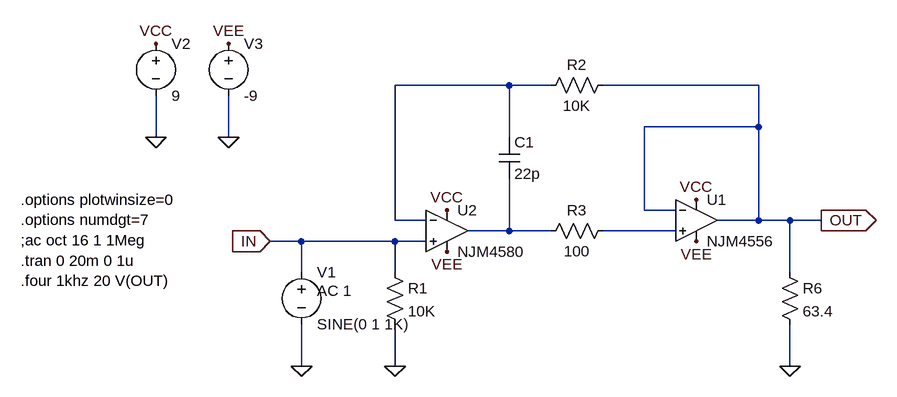
[diagram p0: schematic njm.headphone.amplifier.asc]
njm.headphone.amplifier.asc, the LTspice schematic file:
Version 4
SHEET 1 880 680
WIRE 128 -352 -48 -352
WIRE 192 -352 128 -352
WIRE 512 -352 272 -352
WIRE 512 -288 512 -352
WIRE 512 -288 336 -288
WIRE -416 -272 -416 -336
WIRE -304 -272 -304 -336
WIRE 128 -272 128 -352
WIRE 336 -160 336 -288
WIRE 384 -160 336 -160
WIRE -48 -144 -48 -352
WIRE 0 -144 -48 -144
WIRE 512 -144 512 -288
WIRE 512 -144 448 -144
WIRE 560 -144 512 -144
WIRE 608 -144 560 -144
WIRE 128 -128 128 -208
WIRE 128 -128 64 -128
WIRE 192 -128 128 -128
WIRE 384 -128 272 -128
WIRE -192 -112 -240 -112
WIRE -48 -112 -192 -112
WIRE 0 -112 -48 -112
WIRE -192 -64 -192 -112
WIRE -48 -64 -48 -112
WIRE 560 -64 560 -144
WIRE -192 80 -192 16
WIRE -48 80 -48 16
WIRE 560 80 560 16
FLAG 608 -144 OUT
IOPIN 608 -144 Out
FLAG -48 80 0
FLAG 560 80 0
FLAG -192 80 0
FLAG 32 -160 VCC
FLAG 416 -176 VCC
FLAG 32 -96 VEE
FLAG 416 -112 VEE
FLAG -240 -112 IN
IOPIN -240 -112 In
FLAG -416 -416 VCC
FLAG -304 -416 VEE
FLAG -416 -272 0
FLAG -304 -272 0
SYMBOL res -64 -80 R0
SYMATTR InstName R1
SYMATTR Value 10K
SYMATTR SpiceLine tol=1 pwr=0.1
SYMBOL res 288 -368 R90
WINDOW 0 0 56 VBottom 2
WINDOW 3 32 56 VTop 2
SYMATTR InstName R2
SYMATTR Value 10K
SYMATTR SpiceLine tol=1 pwr=0.1
SYMBOL res 288 -144 R90
WINDOW 0 0 56 VBottom 2
WINDOW 3 32 56 VTop 2
SYMATTR InstName R3
SYMATTR Value 100
SYMATTR SpiceLine tol=1 pwr=0.1
SYMBOL res 544 -80 R0
SYMATTR InstName R6
SYMATTR Value 63.4
SYMATTR SpiceLine tol=1 pwr=0.1
SYMBOL voltage -192 -80 R0
WINDOW 123 24 44 Left 2
WINDOW 39 0 0 Left 2
SYMATTR Value2 AC 1
SYMATTR InstName V1
SYMATTR Value SINE(0 1 1K)
SYMBOL voltage -416 -432 R0
WINDOW 123 0 0 Left 2
WINDOW 39 0 0 Left 2
SYMATTR InstName V2
SYMATTR Value 9
SYMBOL voltage -304 -432 R0
WINDOW 123 0 0 Left 2
WINDOW 39 0 0 Left 2
SYMATTR InstName V3
SYMATTR Value -9
SYMBOL cap 112 -272 R0
SYMATTR InstName C1
SYMATTR Value 22p
SYMATTR SpiceLine V=16 Irms=0 Rser=0.304815 Lser=0.302429f mfg="Wuerth Elektronik" pn="885012005027 WCAP-CSGP 0402" type="NP0"
SYMBOL Opamps\\extra_lib\\NJM4556 416 -208 R0
SYMATTR InstName U1
SYMBOL Opamps\\extra_lib\\NJM4580 32 -192 R0
SYMATTR InstName U2
TEXT -624 -176 Left 2 !.options plotwinsize=0\n.options numdgt=7\n;ac oct 16 1 1Meg\n.tran 0 20m 0 1u\n.four 1khz 20 V(OUT)

The netlist it stands for:
* njm.headphone.amplifier.asc
R1 IN 0 10K tol=1 pwr=0.1
R2 OUT N001 10K tol=1 pwr=0.1
R3 N003 N002 100 tol=1 pwr=0.1
R6 OUT 0 63.4 tol=1 pwr=0.1
V1 IN 0 SINE(0 1 1K) AC 1
V2 VCC 0 9
V3 VEE 0 -9
C1 N001 N002 22p V=16 Irms=0 Rser=0.304815 Lser=0.302429f mfg="Wuerth Elektronik" pn="885012005027 WCAP-CSGP 0402" type="NP0"
XU1 N003 OUT VCC VEE OUT NJM4556  ; pins In+ In- V+ V- OUT
XU2 IN N001 VCC VEE N002 NJM4580  ; pins In+ In- V+ V- OUT
.options plotwinsize=0
.options numdgt=7
;ac oct 16 1 1Meg
.tran 0 20m 0 1u
.four 1khz 20 V(OUT)
.backanno
.end